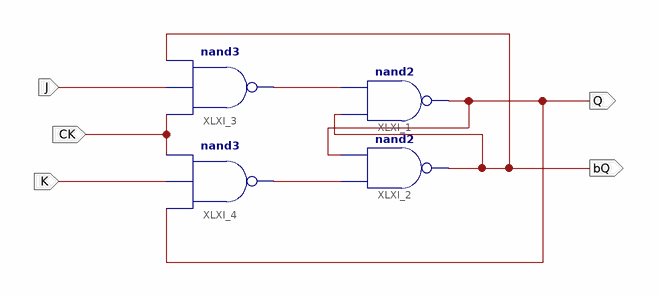
[diagram p0: schematic sheet 1]
// Xilinx ISE schematic JK_FF_C.sch (spartan6) as structural Verilog: 4 symbols, 5 ports
module JK_FF_C (
  input  J,
  input  K,
  input  CK,
  output bQ,
  output Q
);

  wire XLXN_1, XLXN_2;

  nand XLXI_1 (Q, bQ, XLXN_1);
  nand XLXI_2 (bQ, XLXN_2, Q);
  nand XLXI_3 (XLXN_1, CK, J, bQ);
  nand XLXI_4 (XLXN_2, Q, K, CK);
endmodule
